# Altium schematic sheet MP3438 Prototype.SchDoc: MP3438 Test Board
size A4; Author: Joel Mansor; SheetNumber: 1; SheetTotal: 1
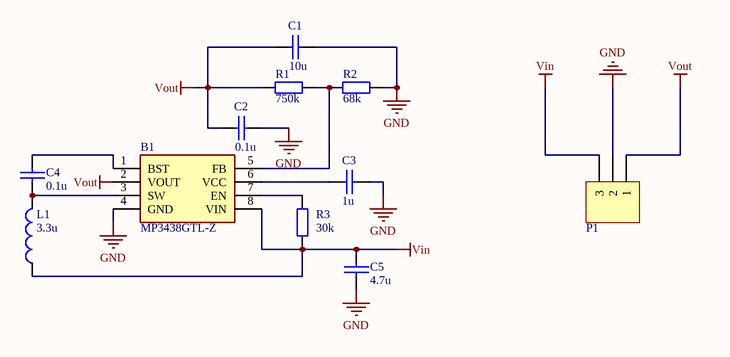
[diagram p0: MP3438 Prototype.SchDoc]

## Parts
B1  MP3438GTL-Z  [SOTFL50P160X60-8N]
C1  10u  [ece-CC2012-0805]
C2  0.1u  [ece-CC2012-0805]
C3  1u  [ece-CC2012-0805]
C4  0.1u  [ece-CC2012-0805]
C5  4.7u  [ece-CC2012-0805]
L1  3.3u  [MPL-AL4020]
P1  Header 3  [ece-HDR1X3]  (value not drawn)
R1  750k  [RESC2012-0805SM]
R2  68k  [RESC2012-0805SM]
R3  30k  [RESC2012-0805SM]

## Nets
GND: B1.4(GND) C1.1 C2.1 C3.1 C5.2 P1.2 R2.1
Vin: B1.8(VIN) C5.1 L1.1 P1.3 R3.1
Vout: B1.2(VOUT) C1.2 C2.2 P1.1 R1.1
NetB1_1: B1.1(BST) C4.1
NetB1_3: B1.3(SW) C4.2 L1.2
NetB1_5: B1.5(FB) R1.2 R2.2
NetB1_6: B1.6(VCC) C3.2
NetB1_7: B1.7(EN) R3.2

## Library data of the parts
B1 = MP3438GTL-Z: Switching Voltage Regulators 2A, 16V, High Efficiency Fully-Integrated Synchronous Boost Converter; Manufacturer_Name: Monolithic Power Systems (MPS); Geometry.Height: 0.6mm; Manufacturer_Part_Number: MP3438GTL-Z; Mouser Part Number: 946-MP3438GTL-Z; Mouser Price/Stock: https://www.mouser.co.uk/ProductDetail/Monolithic-Power-Systems-MPS/MP3438GTL-Z?qs=tlsG%2FOw5FFjfFO8TaWv5UA%3D%3D; Arrow Part Number: *; Arrow Price/Stock: *; Datasheet Link: https://www.monolithicpower.com/en/documentview/productdocument/index/version/2/document_type/Datasheet/lang/en/sku/MP3438GTL/
C1-C5 = CAP SM0805: SM capacitor
  C1: Value: 10u
  C2 C4: Value: 0.1u
  C3: Value: 1u
  C5: Value: 4.7u
L1 = MPL-AL4020-3R3: Low-Resistance Molded Inductor 3.3µH; Value: 3.3u
P1 = Header 3: Header, 3-Pin; LatestRevisionDate: 17-Jul-2002; LatestRevisionNote: Re-released for DXP Platform.; Publisher: Altium Limited
R1-R3 = Res SM 0805: SM resistor
  R1: Value: 750k
  R2: Value: 68k
  R3: Value: 30k